# EAGLE design mLRS-dualE28-board02-v011 (EAGLE 7.5.0)
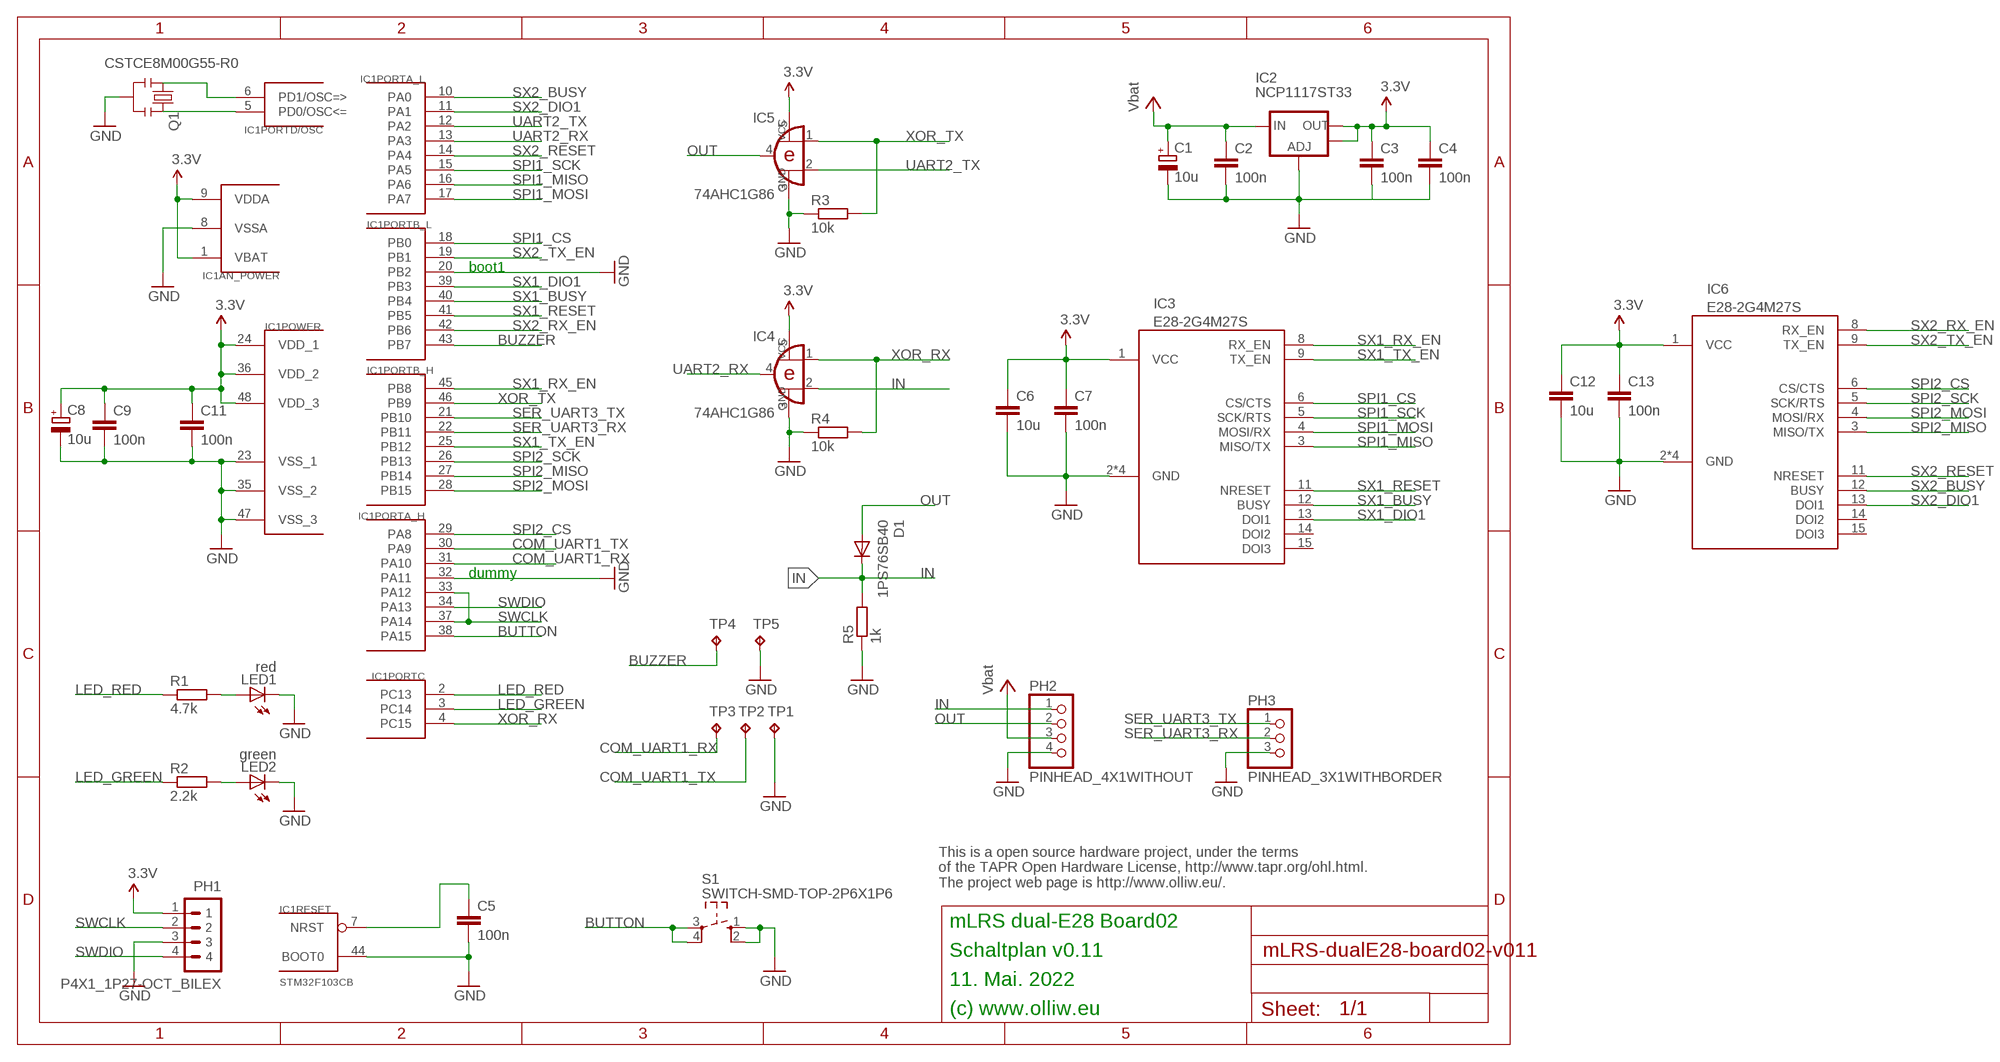
[diagram p0: schematic, sheet 1]

## Parts
C1  10u  CPOL-EUSMCA  [SMC_A]
C2  100n  C-EUC0603  [C0603]
C3  100n  C-EUC0402  [C0402]
C4  100n  C-EUC0402  [C0402]
C5  100n  C-EUC0402  [C0402]
C6  10u  C-EUC0603  [C0603]
C7  100n  C-EUC0402  [C0402]
C8  10u  CPOL-EUSMCA  [SMC_A]
C9  100n  C-EUC0402  [C0402]
C11  100n  C-EUC0402  [C0402]
C12  10u  C-EUC0603  [C0603]
C13  100n  C-EUC0402  [C0402]
D1  1PS76SB40  DIODE-SOD110-R  [SOD110-R]
IC1  STM32F103CB  STM32F10XCXT6  [TQFP48]
IC2  NCP1117ST33  V_REG_LM1117SOT223  [SOT223]
IC3  E28-2G4M27S  E28  [E28-2G4M27]
IC4  74AHC1G86  [SOT23-5-VER1]
IC5  74AHC1G86  [SOT23-5-VER1]
IC6  E28-2G4M27S  E28  [E28-2G4M27]
LED1  red  LEDCHIPLED_0603  [CHIPLED_0603]
LED2  green  LEDCHIPLED_0603  [CHIPLED_0603]
PH1  P4X1_1P27-OCT_BILEX  [4X1_1P27_OCT_BILEX]
PH2  PINHEAD_4X1WITHOUT  [PINHEAD_4X1_WO]
PH3  PINHEAD_3X1WITHBORDER  [PINHEAD_3X1]
Q1  CSTCE8M00G55-R0  RESONATORSMD  [RESONATOR-SMD]
R1  4.7k  R-EU_R0402  [R0402]
R2  2.2k  R-EU_R0402  [R0402]
R3  10k  R-EU_R0402  [R0402]
R4  10k  R-EU_R0402  [R0402]
R5  1k  R-EU_R0402  [R0402]
S1  SWITCH-SMD-TOP-2P6X1P6  [TACTILE-SWITCH-SMD-TOP-2P6X1X6]
TP1  TPB1,27  [B1,27]
TP2  TPB1,27  [B1,27]
TP3  TPB1,27  [B1,27]
TP4  TPTP15R  [TP15R]
TP5  TPTP15R  [TP15R]

## Nets
3.3V: C3.1 C4.1 C6.1 C7.1 C8.+ C9.1 C11.1 C12.1 C13.1 IC1.1(AN_POWER:VBAT) IC1.9(AN_POWER:VDDA) IC1.24(POWER:VDD_1) IC1.36(POWER:VDD_2) IC1.48(POWER:VDD_3) IC2.2(OUT) IC2.4(OUT) IC3.1(VCC) IC4.5(VCC) IC5.5(VCC) IC6.1(VCC) PH1.1
BUTTON: IC1.38(PORTA_H:PA15) S1.3 S1.4
BUZZER: IC1.43(PORTB_L:PB7) TP4.TP
COM_UART1_RX: IC1.31(PORTA_H:PA10) TP3.TP
COM_UART1_TX: IC1.30(PORTA_H:PA9) TP2.TP
GND: C1.- C2.2 C3.2 C4.2 C5.2 C6.2 C7.2 C8.- C9.2 C11.2 C12.2 C13.2 IC1.8(AN_POWER:VSSA) IC1.20(PORTB_L:PB2) IC1.23(POWER:VSS_1) IC1.32(PORTA_H:PA11) IC1.35(POWER:VSS_2) IC1.44(RESET:BOOT0) IC1.47(POWER:VSS_3) IC2.1(ADJ) IC3.2(GND) IC3.7(GND) IC3.10(GND) IC3.16(GND) IC4.3(GND) IC5.3(GND) IC6.2(GND) IC6.7(GND) IC6.10(GND) IC6.16(GND) LED1.C LED2.C PH1.3 PH2.4 PH3.3 Q1.2 R3.1 R4.1 R5.1 S1.1 S1.2 TP1.TP TP5.TP
IN: D1.C IC4.2(I1) PH2.1 R5.2
LED_GREEN: IC1.3(PORTC:PC14) R2.1
LED_RED: IC1.2(PORTC:PC13) R1.1
N$5: C5.1 IC1.7(RESET:NRST)
N$12: IC1.5(PORTD/OSC:PD0/OSC<=) Q1.3
N$14: IC1.6(PORTD/OSC:PD1/OSC=>) Q1.1
N$17: LED1.A R1.2
N$19: LED2.A R2.2
OUT: D1.A IC5.4(O) PH2.2
SER_UART3_RX: IC1.22(PORTB_H:PB11) PH3.2
SER_UART3_TX: IC1.21(PORTB_H:PB10) PH3.1
SPI1_CS: IC1.18(PORTB_L:PB0) IC3.6(CS/CTS)
SPI1_MISO: IC1.16(PORTA_L:PA6) IC3.3(MISO/TX)
SPI1_MOSI: IC1.17(PORTA_L:PA7) IC3.4(MOSI/RX)
SPI1_SCK: IC1.15(PORTA_L:PA5) IC3.5(SCK/RTS)
SPI2_CS: IC1.29(PORTA_H:PA8) IC6.6(CS/CTS)
SPI2_MISO: IC1.27(PORTB_H:PB14) IC6.3(MISO/TX)
SPI2_MOSI: IC1.28(PORTB_H:PB15) IC6.4(MOSI/RX)
SPI2_SCK: IC1.26(PORTB_H:PB13) IC6.5(SCK/RTS)
SWCLK: IC1.33(PORTA_H:PA12) IC1.37(PORTA_H:PA14) PH1.2
SWDIO: IC1.34(PORTA_H:PA13) PH1.4
SX1_BUSY: IC1.40(PORTB_L:PB4) IC3.12(BUSY)
SX1_DIO1: IC1.39(PORTB_L:PB3) IC3.13(DOI1)
SX1_RESET: IC1.41(PORTB_L:PB5) IC3.11(NRESET)
SX1_RX_EN: IC1.45(PORTB_H:PB8) IC3.8(RX_EN)
SX1_TX_EN: IC1.25(PORTB_H:PB12) IC3.9(TX_EN)
SX2_BUSY: IC1.10(PORTA_L:PA0) IC6.12(BUSY)
SX2_DIO1: IC1.11(PORTA_L:PA1) IC6.13(DOI1)
SX2_RESET: IC1.14(PORTA_L:PA4) IC6.11(NRESET)
SX2_RX_EN: IC1.42(PORTB_L:PB6) IC6.8(RX_EN)
SX2_TX_EN: IC1.19(PORTB_L:PB1) IC6.9(TX_EN)
UART2_RX: IC1.13(PORTA_L:PA3) IC4.4(O)
UART2_TX: IC1.12(PORTA_L:PA2) IC5.2(I1)
VCC: C1.+ C2.1 IC2.3(IN) PH2.3 ; supply symbol labelled Vbat
XOR_RX: IC1.4(PORTC:PC15) IC4.1(I0) R4.2
XOR_TX: IC1.46(PORTB_H:PB9) IC5.1(I0) R3.2
Unconnected: IC3.14(DOI2) IC3.15(DOI3) IC6.14(DOI2) IC6.15(DOI3)

## Notes on the sheet
- boot1
- dummy
- This is a open source hardware project, under the terms
  of the TAPR Open Hardware License, http://www.tapr.org/ohl.html.
  The project web page is http://www.olliw.eu/.
- mLRS dual-E28 Board02
- Schaltplan v0.11
- 11. Mai. 2022
- (c) www.olliw.eu

## Library data of the parts
C1 C8 = rcl:CPOL-EU: POLARIZED CAPACITOR, European symbol
C2-C7 C9 C11-C13 = rcl:C-EU: CAPACITOR, European symbol
D1 = diode:DIODE-: DIODE
IC1 = # stm32:STM32F10XCXT6: ST STM32F101/103 48pin LQFP
IC2 = # SparkFun2:V_REG_LM1117: Voltage Regulator LM1117 Standard adjustable voltage regulator but in SMD form. Spark Fun Electronics SKU : COM-00595
IC3 IC6 = # stdlib:E28
IC4 IC5 = # stdlib:74AHC1G86
LED1 LED2 = led:LED: LED OSRAM: - CHIPLED LG R971, LG N971, LY N971, LG Q971, LY Q971, LO R971, LY R971 LH N974, LH R974 LS Q976, LO Q976, LY Q976 LO Q996 - Hyper CHIPLED LW Q18S LB Q993, LB Q99A, LB R99A - SideLED LS A670, LO A670, LY A670, LG A670, LP A670 LB A673, LV A673, LT A673, LW A673 LH A674 LY A675 LS A676, LA A676, LO A676, LY A676, LW A676 LS A679, LY A679, LG A679 - Hyper Micro SIDELED® LS Y876, LA Y876, LO Y876, LY Y876 LT Y87S - SmartLED LW L88C, LW L88S LB L89C, LB L89S, LG L890 LS L89K, LO L89K, LY L89K LS L896, LA L896, LO L896, LY L896 - TOPLED LS T670, LO T670, LY T670, LG T670, LP T670 LSG T670, LSP T670, LSY T670, LOP T670, LYG T670 LG T671, LOG T671, LSG T671 LB T673, LV T673, LT T673, LW T673 LH T674 LS T676, LA T676, LO T676, LY T676, LB T676, LH T676, LSB T676, LW T676 LB T67C, LV T67C, LT T67C, LS T67K, LO T67K, LY T67K, LW E67C LS E67B, LA E67B, LO E67B, LY E67B, LB E67C, LV E67C, LT E67C LW T67C LS T679, LY T679, LG T679 LS T770, LO T770, LY T770, LG T770, LP T770 LB T773, LV T773, LT T773, LW T773 LH T774 LS E675, LA E675, LY E675, LS T675 LS T776, LA T776, LO T776, LY T776, LB T776 LHGB T686 LT T68C, LB T68C - Hyper Mini TOPLED® LB M676 - Mini TOPLED Santana® LG M470 LS M47K, LO M47K, LY M47K Source: http://www.osram.convergy.de LUXEON: - LUMILED® LXK2-PW12-R00, LXK2-PW12-S00, LXK2-PW14-U00, LXK2-PW14-V00 LXK2-PM12-R00, LXK2-PM12-S00, LXK2-PM14-U00 LXK2-PE12-Q00, LXK2-PE12-R00, LXK2-PE12-S00, LXK2-PE14-T00, LXK2-PE14-U00 LXK2-PB12-K00, LXK2-PB12-L00, LXK2-PB12-M00, LXK2-PB14-N00, LXK2-PB14-P00, LXK2-PB14-Q00 LXK2-PR12-L00, LXK2-PR12-M00, LXK2-PR14-Q00, LXK2-PR14-R00 LXK2-PD12-Q00, LXK2-PD12-R00, LXK2-PD12-S00 LXK2-PH12-R00, LXK2-PH12-S00 LXK2-PL12-P00, LXK2-PL12-Q00, LXK2-PL12-R00 Source: www.luxeon.com KINGBRIGHT: KA-3528ASYC Source: www.kingbright.com
PH1 = # stdlib:P4X1_1P27
PH2 = # stdlib:PINHEAD_4X1
PH3 = # stdlib:PINHEAD_3X1
Q1 = # SparkFun2:RESONATOR: Resonator Small SMD resonator. This is the itty bitty 10/20MHz resonators with built in caps. CSTCE10M0G55 and CSTCE20M0V53. Footprint has been reviewed closely but hasn't been tested yet.
R1-R5 = rcl:R-EU_: RESISTOR, European symbol
S1 = # stdlib:SWITCH-SMD-TOP-2P6X1P6
TP1-TP5 = testpad:TP: Test pad

## Board
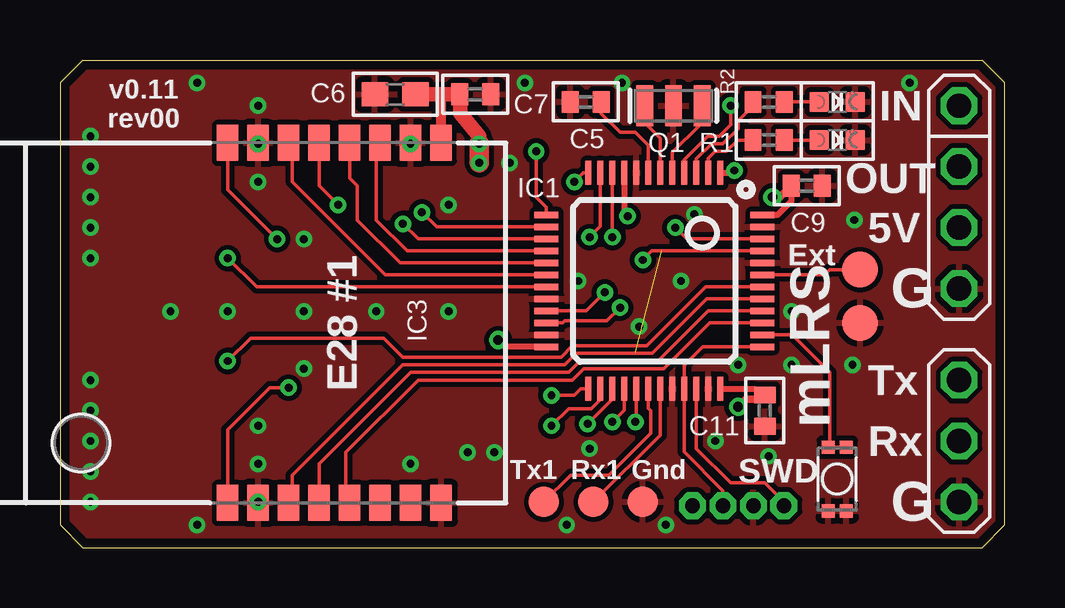
[diagram p1: board, top side]
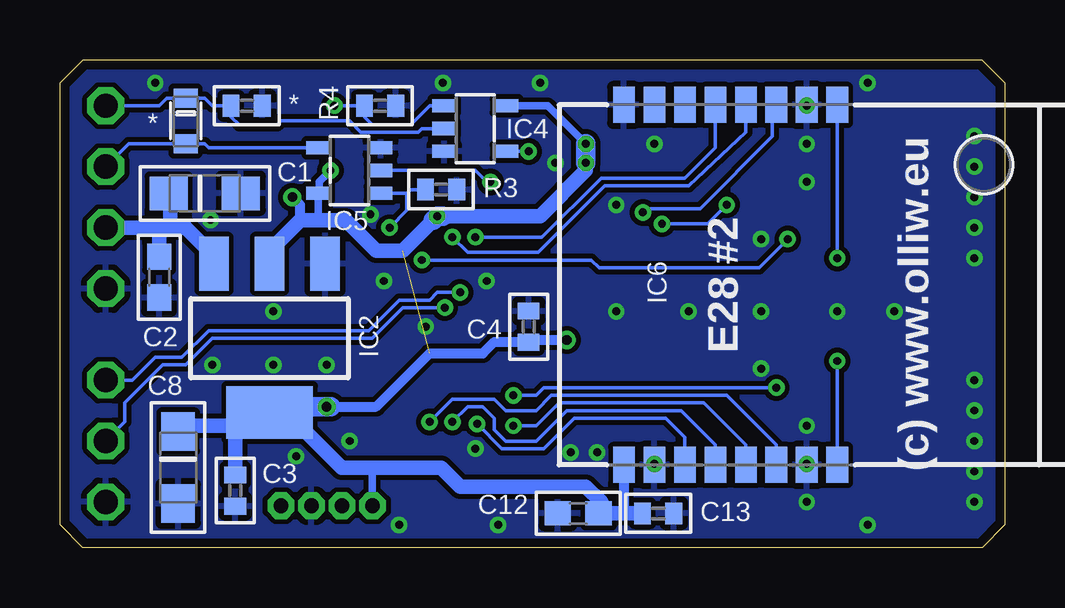
[diagram p2: board, bottom side, seen from below]

Size 39.37 x 20.32 mm. Coordinates in mm from the lower left corner, seen from the top.
Outline: 38.42,0 39.37,0.95 39.37,19.37 38.42,20.32 0.95,20.32 0,19.37 0,0.95 0.95,0 38.42,0
Copper layers (1*16): Top 0.0356mm / dielectric 1.5011mm / Bottom 0.0356mm
Design rules "ow-oshpark-2layer": minimum track width 6mil, minimum drill 13mil, track to track 6mil, track to pad 6mil, pad to pad 6mil, via to via 6mil, smd to smd 6mil, copper to edge 15mil, drill to drill 6mil, minimum pad ring 7mil, minimum via ring 7mil, stop-mask expansion 2.5mil, vias tented up to drill 26mil, thermal gap 10mil

### Footprints (pad centres in the part's own frame; a part is rotated, then mirrored left to right if it is on the bottom)
SMC_A = smd 1.6 x 1.4: + -1.5,0; - 1.5,0
C0603 = smd 1.1 x 1: 1 -0.85,0; 2 0.85,0
C0402 = smd 0.7 x 0.9: 1 -0.65,0; 2 0.65,0
SOD110-R = smd 0.8 x 1: A 0.95,0; C -0.95,0
TQFP48 = smd 0.254 x 1: 1 -2.75,-4.5; 2 -2.25,-4.5; 3 -1.75,-4.5; 4 -1.25,-4.5; 5 -0.75,-4.5; 6 -0.25,-4.5; 7 0.25,-4.5; 8 0.75,-4.5; 9 1.25,-4.5; 10 1.75,-4.5; 11 2.25,-4.5; 12 2.75,-4.5; 25 2.75,4.5; 26 2.25,4.5; 27 1.75,4.5; 28 1.25,4.5; 29 0.75,4.5; 30 0.25,4.5; 31 -0.25,4.5; 32 -0.75,4.5; 33 -1.25,4.5; 34 -1.75,4.5; 35 -2.25,4.5; 36 -2.75,4.5 | smd 1 x 0.254: 13 4.5,-2.75; 14 4.5,-2.25; 15 4.5,-1.75; 16 4.5,-1.25; 17 4.5,-0.75; 18 4.5,-0.25; 19 4.5,0.25; 20 4.5,0.75; 21 4.5,1.25; 22 4.5,1.75; 23 4.5,2.25; 24 4.5,2.75; 37 -4.5,2.75; 38 -4.5,2.25; 39 -4.5,1.75; 40 -4.5,1.25; 41 -4.5,0.75; 42 -4.5,0.25; 43 -4.5,-0.25; 44 -4.5,-0.75; 45 -4.5,-1.25; 46 -4.5,-1.75; 47 -4.5,-2.25; 48 -4.5,-2.75
SOT223 = smd 1.219 x 2.235: 1 -2.311,-3.099; 2 0,-3.099; 3 2.311,-3.099 | smd 3.6 x 2.2: 4 0,3.099
E28-2G4M27 = smd 1.5 x 0.9: 1 7.5,0; 2 7.5,1.27; 3 7.5,2.54; 4 7.5,3.81; 5 7.5,5.08; 6 7.5,6.35; 7 7.5,7.62; 8 7.5,8.89; 9 -7.5,8.89; 10 -7.5,7.62; 11 -7.5,6.35; 12 -7.5,5.08; 13 -7.5,3.81; 14 -7.5,2.54; 15 -7.5,1.27; 16 -7.5,0
SOT23-5-VER1 = smd 0.55 x 0.99: 1 -0.95,-1.29; 2 0,-1.29; 3 0.95,-1.29; 4 0.95,1.3; 5 -0.95,1.3
CHIPLED_0603 = smd 0.8 x 0.8: A 0,-0.75; C 0,0.75
4X1_1P27_OCT_BILEX = drill 0.61 pad 1.118 octagon: 1 0,0; 2 0,-1.27; 3 0,-2.54; 4 0,-3.81
PINHEAD_4X1_WO = drill 1.016 octagon: 1 0,0; 2 0,-2.54; 3 0,-5.08; 4 0,-7.62
PINHEAD_3X1 = drill 1.016 octagon: 1 0,0; 2 0,-2.54; 3 0,-5.08
RESONATOR-SMD = smd 0.7 x 1.7: 1 -1.2,0; 2 0,0; 3 1.2,0
R0402 = smd 0.7 x 0.9: 1 -0.65,0; 2 0.65,0
TACTILE-SWITCH-SMD-TOP-2P6X1X6 = smd 0.55 x 0.55: 1 -1.325,0.375; 2 -1.325,-0.375; 3 1.325,-0.375; 4 1.325,0.375
B1,27 = smd 1.27 x 1.27: TP 0,0
TP15R = smd 1.5 x 1.5: TP 0,0

### Placement (x,y rotation side)
C1  33.34,14.76 0 bottom
C2  35.24,11.27 270 bottom
C3  32.07,2.38 270 bottom
C4  19.84,9.21 90 bottom
C5  21.91,18.57 180 top
C6  13.97,18.89 180 top
C7  17.3,18.89 0 top
C8  34.45,3.33 270 bottom
C9  31.11,15.08 0 top
C11  29.37,5.71 270 top
C12  17.78,1.43 180 bottom
C13  14.45,1.43 0 bottom
D1  34.13,17.78 270 bottom
IC1  24.77,11.11 180 top
IC2  30.64,8.73 180 bottom
IC3  15.87,9.37 90 top
IC4  22.07,17.46 270 bottom
IC5  27.3,15.72 90 bottom
IC6  15.87,10.95 270 bottom
LED1  32.38,16.99 270 top
LED2  32.38,18.57 270 top
PH1  26.35,1.75 90 top
PH2  37.46,18.41 0 top
PH3  37.46,6.98 0 top
Q1  25.56,18.41 0 top
R1  29.53,16.99 0 top
R2  29.53,18.57 0 top
R3  23.5,14.92 180 bottom
R4  26.04,18.41 180 bottom
R5  31.59,18.41 180 bottom
S1  32.38,2.86 90 top
TP1  24.29,1.91 0 top
TP2  20.16,1.91 0 top
TP3  22.23,1.91 0 top
TP4  33.34,11.59 0 top
TP5  33.34,9.37 0 top

### Tracks (layer width: path | path; a pad name or v marks a point on that pad's centre or on a via)
3.3V  (via drill 0.33, 0.4)  (1 unrouted)
  Top 0.152: 30.48,15.07 C9.1
  Top 0.254: IC1.9 23.52,13.95 v23.65,13.81 | IC1.1 28,15.61 v28.1,15.72 | IC1.48 29.9,13.86 30.48,14.45 30.48,15.07 | IC1.36 28.95,6.61 29.21,6.35 29.35,6.35 C11.1 | IC1.24 18.55,8.36 v18.26,8.65
  Top 0.305: v29.69,14.6 29.99,14.6 C9.1 | v28.26,5.87 28.57,6.19 29.2,6.19 C11.1
  Top 0.406: IC3.1 15.87,18.89
  Top 0.61: C6.1 15.87,18.89 C7.1 16.67,18.88 16.67,18.1 17.46,17.15 v17.46,16.83
  Top 0.813: v17.46,16.03 v17.46,16.83
  Bottom 0.152: 28.57,14.8 IC5.5
  Bottom 0.305: IC5.5 28.61,13.78 27.94,13.65 | 28.57,14.8 28.57,15.24 v28.1,15.72 | 30.96,5.87 31.27,5.56 | IC4.5 19.05,18.41 v17.46,16.83 | 19.45,8.65 C4.1 | PH1.1 26.35,3.18 26.19,3.33
  Bottom 0.406: IC6.1 15.87,1.43 | 29.37,13.65 29.37,14.29 v29.69,14.6 | 30.16,5.87 30.96,5.87 | v18.26,8.65 19.45,8.65 | C4.1 19.7,8.57 21.27,8.57 21.75,8.1 23.97,8.1 26.19,5.87 28.1,5.87
  Bottom 0.61: C13.1 15.87,1.43 C12.1 16.83,1.49 16.83,1.91 17.46,2.54 22.7,2.54 23.5,3.33 26.19,3.33 27.62,3.33 30.16,5.87 | IC2.2 30.64,12.38 29.37,13.65 27.94,13.65 27.46,13.65 26.19,12.38 25.08,12.38 v23.65,13.81 19.37,13.81 17.46,15.72 v17.46,16.03 | C3.1 32.07,5.4 31.91,5.56 31.59,5.56 | 31.59,5.56 31.27,5.56 30.71,5.56 IC2.4 | C8.+ 34.45,5.08 32.07,5.08 31.59,5.56
  Bottom 0.813: 23.81,13.65 v23.65,13.81 23.42,13.81 | 30.16,5.87 v28.26,5.87 28.1,5.87 | v17.46,16.03 v17.46,16.83
BUTTON
  Top 0.152: S1.3 S1.4 32.07,4.28 32.07,7.3 30.51,8.86 IC1.38
BUZZER
  Top 0.152: IC1.43 31.82,11.36 32.07,11.59 TP4.TP
COM_UART1_RX
  Top 0.152: IC1.31 25.02,4.7 TP3.TP
COM_UART1_TX
  Top 0.152: IC1.30 24.52,5.81 24.61,5.71 24.61,4.76 22.86,3.02 21.27,3.02 TP2.TP
GND  (via drill 0.33)
  other vias: 1.27,17.15 1.27,1.91 1.27,3.18 1.27,4.45 1.27,5.71 1.27,6.98 1.27,15.87 1.27,14.6 1.27,13.33 1.27,12.06 8.25,16.83 14.6,16.83 8.25,3.49 8.25,18.41 14.6,3.49 8.25,1.91 16.19,14.29 10.16,12.86 8.25,15.24 8.25,5.08 10.16,7.46 10.16,9.84 13.18,9.84 16.19,9.84 16.99,3.97 18.1,3.97 22.07,4.13 27.3,4.45 29.53,3.81 28.26,7.62 30.48,7.62 33.02,7.62 30.48,9.84 25.88,11.11 24.13,9.21 21.59,11.11 26.43,13.89 33.1,13.65 35.4,19.37 25.24,0.95 21.11,0.95 5.71,0.95 5.71,19.37 19.37,19.37 6.98,9.84 4.6,9.84 18.73,16.03 23.42,19.37
  pour Bottom (isolate 0.203, rank 6): 0.32,20 39.05,20 39.05,0.32 0.32,0.32
  pour Top (isolate 0.203, rank 6): 0.32,20 39.05,20 39.05,0.32 0.32,0.32
IN
  Bottom 0.152: IC4.2 24.29,17.46 24.45,17.3 26.83,17.3 27.3,17.78 30.16,17.78 30.32,17.62 31.91,17.62 32.23,17.94 32.23,18.1 32.24,18.11 R5.2 33.02,18.41 33.34,18.73 D1.C | D1.C 34.92,18.73 35.24,18.41 PH2.1 | D1.C
LED_GREEN
  Top 0.152: IC1.3 26.52,16.2 27.15,16.83 27.62,16.83 28.26,17.46 28.26,17.8 28.88,18.41 R2.1
LED_RED
  Top 0.152: IC1.2 27.02,16.22 27.3,16.51 27.77,16.51 28.24,16.99 R1.1
N$5
  Top 0.152: IC1.7 24.52,16.76 23.97,17.3 23.34,17.3 22.56,18.08 C5.1
N$12
  Top 0.152: IC1.5 25.52,16.47 26.67,17.62 26.67,18.48 Q1.3
N$14
  Top 0.152: IC1.6 25.02,17.05 24.29,17.78 24.29,18.64 Q1.1
N$17
  Top 0.152: R1.2 LED1.A
N$19
  Top 0.152: R2.2 LED2.A
OUT
  Bottom 0.152: IC5.4 29.37,16.67 29.69,16.67 33.18,16.67 33.34,16.83 D1.A | D1.A 36.51,16.83 PH2.2 | D1.A
SER_UART3_RX  (via drill 0.33)
  Top 0.152: IC1.22 20.95,9.36 21.03,9.45 22.78,9.45 v23.34,10
  Bottom 0.152: PH3.2 36.67,5.24 36.67,6.03 35.08,7.62 34.13,7.62 33.02,8.73 26.35,8.73 25.08,10 v23.34,10
SER_UART3_TX  (via drill 0.33)
  Top 0.152: IC1.21 21.93,9.86 v22.7,10.64
  Bottom 0.152: PH3.1 36.35,6.98 35.4,7.94 34.29,7.94 33.18,9.05 26.51,9.05 25.24,10.32 23.97,10.32 23.65,10.64 v22.7,10.64
SPI1_CS
  Top 0.152: IC1.18 13.56,11.36 9.68,15.24 9.68,16.51 9.53,16.67 IC3.6
SPI1_MISO
  Top 0.152: IC1.16 14.47,12.36 13.18,13.65 13.18,16.35 13.33,16.51 IC3.3
SPI1_MOSI
  Top 0.152: IC1.17 14.17,11.86 12.38,13.65 12.38,15.08 12.06,15.4 IC3.4
SPI1_SCK  (via drill 0.33)
  Top 0.152: IC1.15 14.92,12.86 v14.29,13.49 | v11.59,14.29 10.79,15.08 IC3.5
  Bottom 0.152: v14.29,13.49 12.38,13.49 v11.59,14.29
SPI2_CS  (via drill 0.33)
  Top 0.152: IC1.29 24.02,5.28 v23.97,5.24
  Bottom 0.152: v23.97,5.24 23.02,6.19 21.27,6.19 20.8,5.71 19.53,5.71 18.89,6.35 11.59,6.35 9.53,4.29 IC6.6
SPI2_MISO  (via drill 0.33)
  Top 0.152: IC1.27 23.02,6.19 v21.99,5.16
  Bottom 0.152: v21.99,5.16 20.96,4.13 19.21,4.13 17.94,5.4 14.13,5.4 13.33,4.6 IC6.3
SPI2_MOSI  (via drill 0.33)
  Top 0.152: IC1.28 23.52,5.73 v23.02,5.24
  Bottom 0.152: IC6.4 12.06,4.29 13.49,5.71 18.26,5.71 19.53,4.45 20.8,4.45 21.27,4.92 21.27,5.4 21.75,5.87 22.38,5.87 v23.02,5.24
SPI2_SCK  (via drill 0.33)
  Top 0.152: IC1.26 22.52,6.16 22.15,5.79 21.19,5.79 v20.48,5.08
  Bottom 0.152: v20.48,5.08 19.53,5.08 18.57,6.03 12.54,6.03 10.79,4.29 IC6.5
SWCLK
  Top 0.152: IC1.37 26.78,8.36 26.02,7.6 IC1.33 26.02,3.99 27.62,2.38 PH1.2
SWDIO
  Top 0.152: IC1.34 26.52,4.12 27.94,2.7 29.37,2.7 30.16,1.91 PH1.4
SX1_BUSY
  Top 0.152: IC1.40 27.01,9.86 24.92,7.78 21.67,7.78 21.19,7.3 14.6,7.3 10.79,3.49 IC3.12
SX1_DIO1
  Top 0.152: IC1.39 27.06,9.36 25.16,7.46 21.83,7.46 21.35,6.98 14.92,6.98 11.91,3.97 11.91,2.03 IC3.13
SX1_RESET
  Top 0.152: IC1.41 26.95,10.36 24.69,8.1 21.51,8.1 21.03,7.62 14.29,7.62 9.68,3.02 9.68,2.06 IC3.11
SX1_RX_EN  (via drill 0.33)
  Top 0.152: IC1.45 24.67,12.36 v24.29,11.99 | v9.05,12.86 6.98,14.92 IC3.8
  Bottom 0.152: v24.29,11.99 17.22,11.99 16.91,11.67 10.24,11.67 v9.05,12.86
SX1_TX_EN  (via drill 0.33)
  Top 0.152: IC1.25 21.69,6.61 21.43,6.35 v20.48,6.35 | v9.53,6.67 8.73,6.67 6.98,4.92 IC3.9
  Bottom 0.152: v20.48,6.35 19.53,6.35 19.21,6.67 v9.53,6.67
SX2_BUSY  (via drill 0.33)
  Top 0.152: IC1.10 v23.02,12.94
  Bottom 0.152: v23.02,12.94 22.38,12.3 19.45,12.3 16.67,15.08 13.18,15.08 10.79,17.3 IC6.12 10.79,18.61
SX2_DIO1  (via drill 0.33)
  Top 0.152: IC1.11 22.52,13.39 v22.07,12.94
  Bottom 0.152: v22.07,12.94 19.29,12.94 16.83,15.4 13.33,15.4 12.06,16.67 IC6.13
SX2_RESET  (via drill 0.33)
  Top 0.152: IC1.14 15.69,13.36 v15.08,13.97
  Bottom 0.152: v15.08,13.97 14.92,14.13 12.7,14.13 9.68,17.15 9.68,18.3 IC6.11
SX2_RX_EN  (via drill 0.33)
  Top 0.152: IC1.42 26.9,10.86 24.45,8.41 21.35,8.41 20.88,7.94 14.29,7.94 13.49,8.73 7.94,8.73 v6.98,7.78
  Bottom 0.152: v6.98,7.78 IC6.8
SX2_TX_EN  (via drill 0.33)
  Top 0.152: IC1.19 8.19,10.86 v6.98,12.06
  Bottom 0.152: v6.98,12.06 IC6.9
UART2_RX  (via drill 0.33)
  Top 0.152: IC1.13 20.27,14.18 19.84,14.6 v19.84,16.51
  Bottom 0.152: v19.84,16.51 20.32,16.51 20.48,16.48 IC4.4
UART2_TX  (via drill 0.33)
  Top 0.152: IC1.12 21.8,15.61 v21.43,15.24
  Bottom 0.152: v21.43,15.24 21.59,15.24 22.07,15.72 IC5.2
VCC
  Bottom 0.61: PH2.3 35.24,13.33 | 35.24,13.33 C2.1 | IC2.3 33.11,12.31 34.13,13.33 34.77,13.33 | 34.77,13.33 35.24,13.33 | C1.+ 34.77,14.76 34.77,13.33
XOR_RX  (via drill 0.33)
  Top 0.152: IC1.4 26.02,16.17 26.99,17.15 27.46,17.15 27.94,17.62 v27.94,18.41
  Bottom 0.152: IC4.1 23.97,18.41 24.77,17.62 26.35,17.62 26.67,17.94 26.67,18.56 R4.2 v27.94,18.41
XOR_TX  (via drill 0.33)
  Top 0.152: IC1.46 26.11,12.86 v25.64,13.33
  Bottom 0.152: R3.2 24.77,14.92 24.92,14.76 | IC5.1 24.93,14.77 24.92,14.76 | v25.64,13.33 24.92,14.05 24.92,14.76

### Text on the board
tNames: v0.11 / rev00 | IN | OUT | 5V | Ext | G | E28 #1 | mLRS | Tx | Rx | Tx1 | Rx1 | Gnd | SWD | G
bNames: * | * | E28 #2 | (c) www.olliw.eu